# EAGLE board snesram (EAGLE 5.04), part 1 of 2
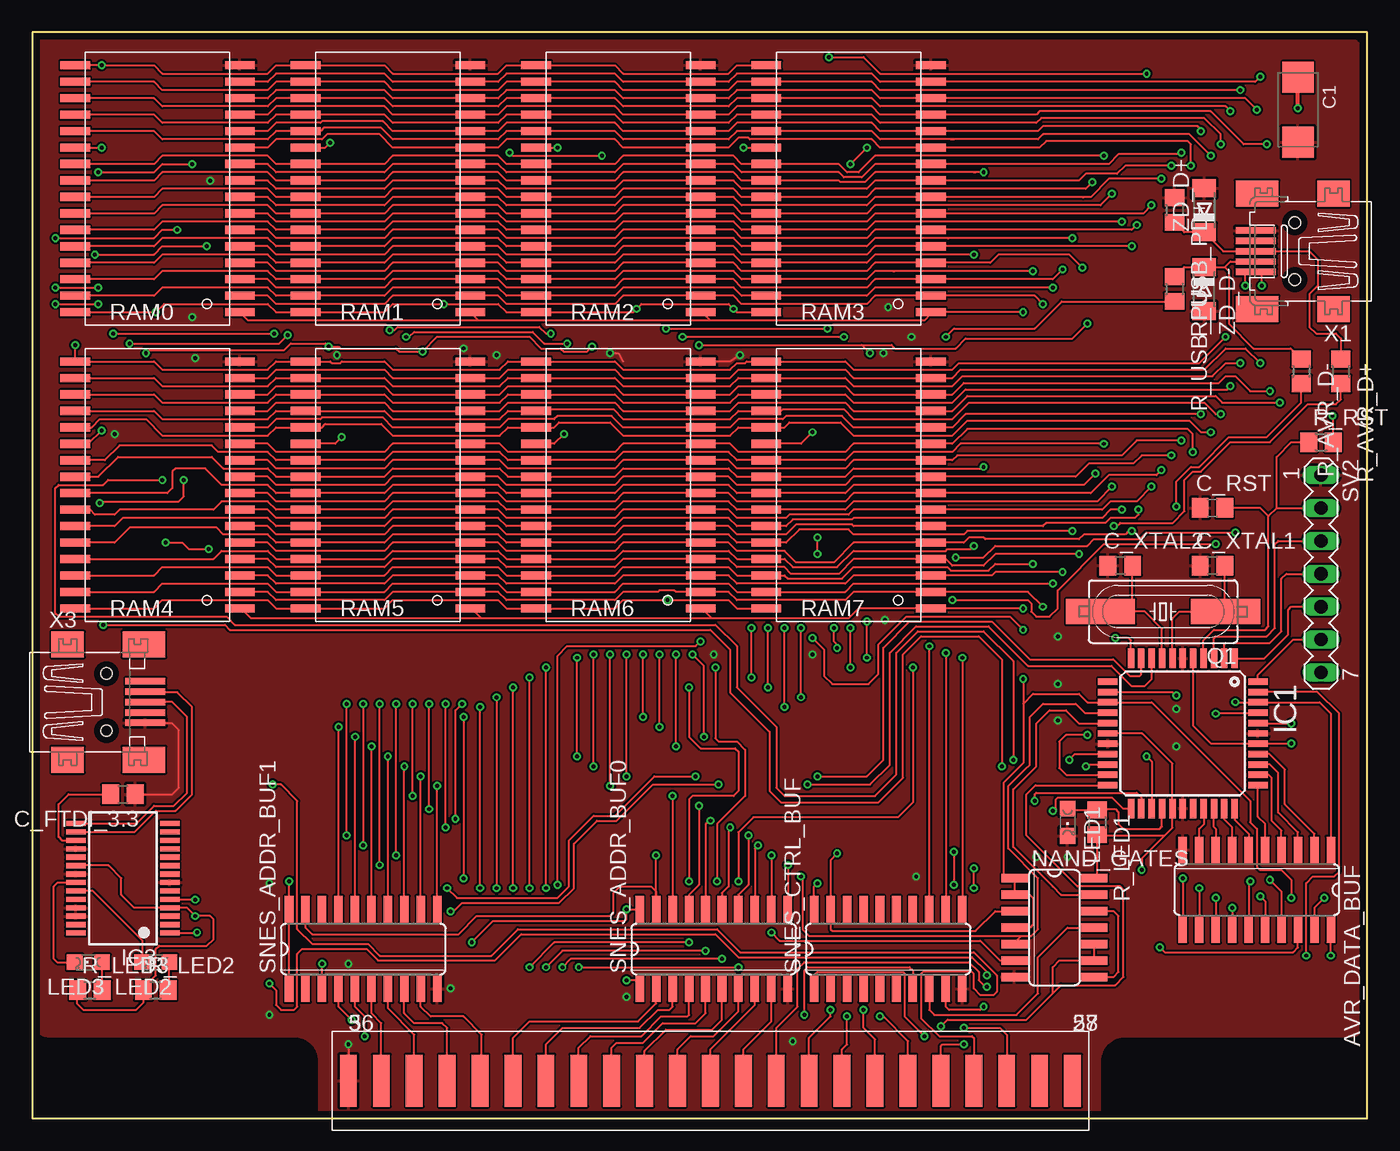
[diagram p2: board, top side]
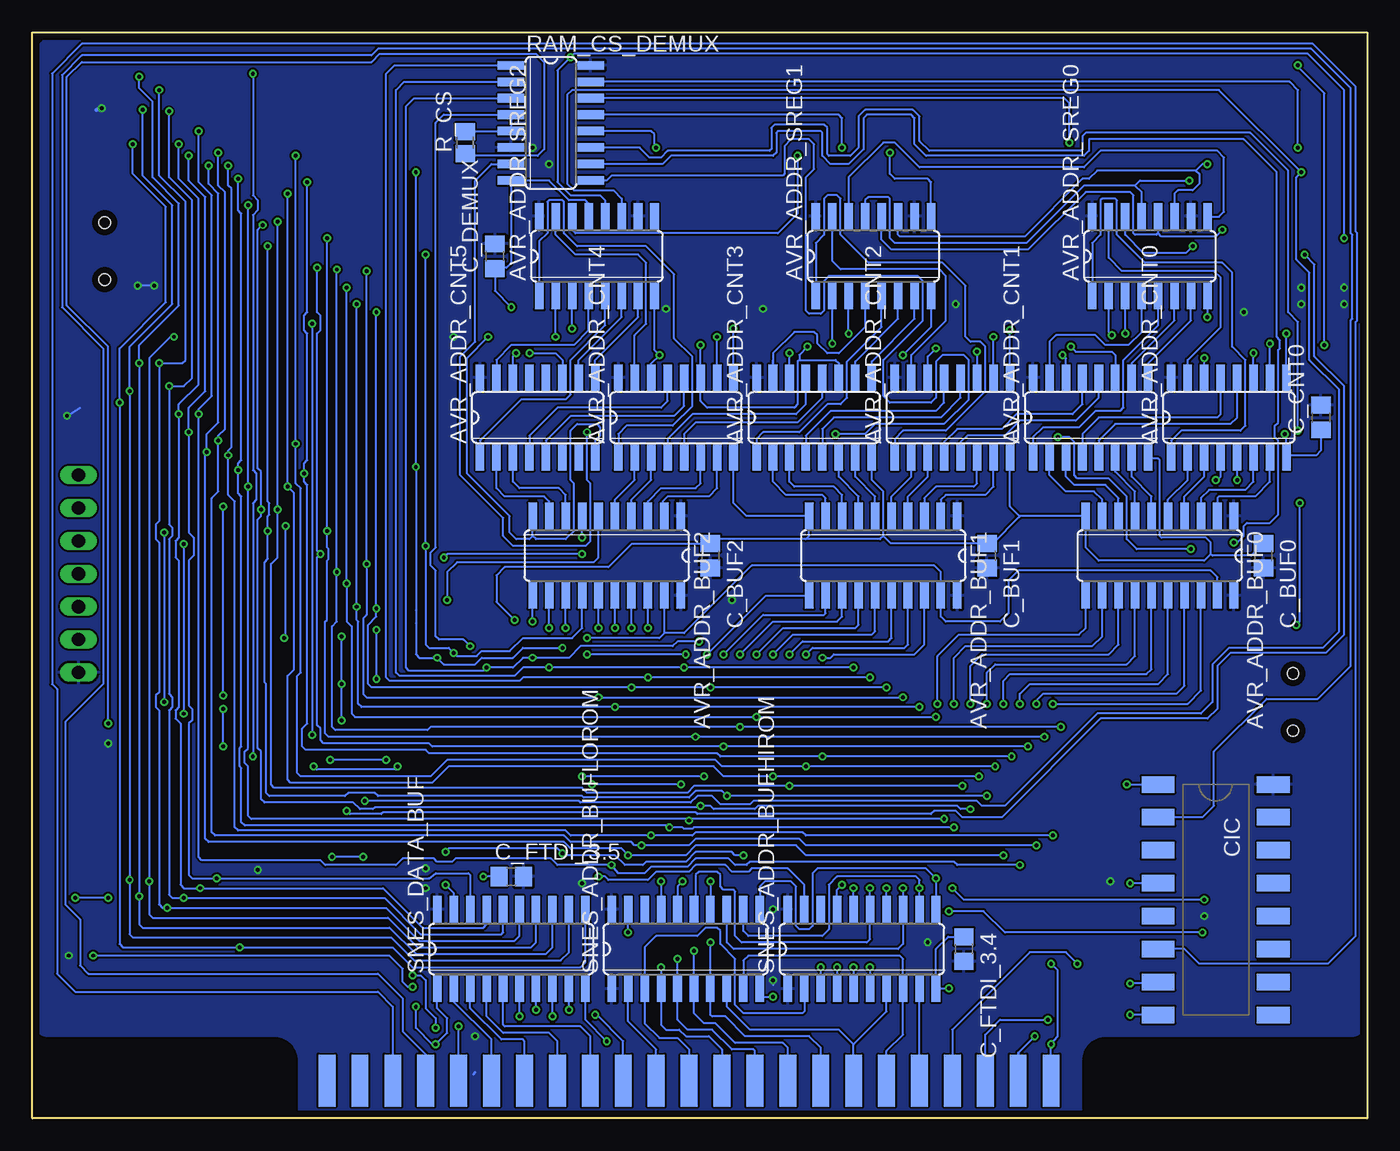
[diagram p3: board, bottom side, seen from below]

Size 103 x 83.82 mm. Coordinates in mm from the lower left corner, seen from the top.
Outline: 103,0 103,83.82 0,83.82 0,0 103,0
Copper layers (1*16): Top 0.035mm / dielectric 1.5mm / Bottom 0.035mm
Design rules "PCB-POOL *": minimum track width 6mil, minimum drill 12mil, track to track 6mil, track to pad 6mil, pad to pad 6mil, via to via 6mil, smd to smd 6mil, copper to edge 20mil, drill to drill 8mil, minimum pad ring 8mil, minimum via ring 6mil, stop-mask expansion 3mil, vias tented up to drill 99mil, thermal gap 8mil

## Footprints (pad centres in the part's own frame; a part is rotated, then mirrored left to right if it is on the bottom)
SO20 = smd 0.66 x 2.032: 1 -5.715,-3.073; 2 -4.445,-3.073; 3 -3.175,-3.073; 4 -1.905,-3.073; 5 -0.635,-3.073; 6 0.635,-3.073; 7 1.905,-3.073; 8 3.175,-3.073; 9 4.445,-3.073; 10 5.715,-3.073; 11 5.715,3.073; 12 4.445,3.073; 13 3.175,3.073; 14 1.905,3.073; 15 0.635,3.073; 16 -0.635,3.073; 17 -1.905,3.073; 18 -3.175,3.073; 19 -4.445,3.073; 20 -5.715,3.073
SO16 = smd 0.66 x 2.032: 1 -4.445,-3.073; 2 -3.175,-3.073; 3 -1.905,-3.073; 4 -0.635,-3.073; 5 0.635,-3.073; 6 1.905,-3.073; 7 3.175,-3.073; 8 4.445,-3.073; 9 4.445,3.073; 10 3.175,3.073; 11 1.905,3.073; 12 0.635,3.073; 13 -0.635,3.073; 14 -1.905,3.073; 15 -3.175,3.073; 16 -4.445,3.073
SMC_C = smd 2.4 x 2.4: + -2.5,0; - 2.5,0
C0805 = smd 1.3 x 1.5: 1 -0.95,0; 2 0.95,0
DIL16_SMD = smd 1.27 x 2.54: 1 -8.89,-4.445; 2 -6.35,-4.445; 3 -3.81,-4.445; 4 -1.27,-4.445; 5 1.27,-4.445; 6 3.81,-4.445; 7 6.35,-4.445; 8 8.89,-4.445; 9 8.89,4.445; 10 6.35,4.445; 11 3.81,4.445; 12 1.27,4.445; 13 -1.27,4.445; 14 -3.81,4.445; 15 -6.35,4.445; 16 -8.89,4.445
TQFP44 = smd 1.5 x 0.5: 1 -5.8,4; 2 -5.8,3.2; 3 -5.8,2.4; 4 -5.8,1.6; 5 -5.8,0.8; 6 -5.8,0; 7 -5.8,-0.8; 8 -5.8,-1.6; 9 -5.8,-2.4; 10 -5.8,-3.2; 11 -5.8,-4; 23 5.8,-4; 24 5.8,-3.2; 25 5.8,-2.4; 26 5.8,-1.6; 27 5.8,-0.8; 28 5.8,0; 29 5.8,0.8; 30 5.8,1.6; 31 5.8,2.4; 32 5.8,3.2; 33 5.8,4 | smd 0.5 x 1.5: 12 -4,-5.8; 13 -3.2,-5.8; 14 -2.4,-5.8; 15 -1.6,-5.8; 16 -0.8,-5.8; 17 0,-5.8; 18 0.8,-5.8; 19 1.6,-5.8; 20 2.4,-5.8; 21 3.2,-5.8; 22 4,-5.8; 34 4,5.8; 35 3.2,5.8; 36 2.4,5.8; 37 1.6,5.8; 38 0.8,5.8; 39 0,5.8; 40 -0.8,5.8; 41 -1.6,5.8; 42 -2.4,5.8; 43 -3.2,5.8; 44 -4,5.8
SSOP28 = smd 0.4 x 1.5: 1 -4.225,-3.625; 2 -3.575,-3.625; 3 -2.925,-3.625; 4 -2.275,-3.625; 5 -1.625,-3.625; 6 -0.975,-3.625; 7 -0.325,-3.625; 8 0.325,-3.625; 9 0.975,-3.625; 10 1.625,-3.625; 11 2.275,-3.625; 12 2.925,-3.625; 13 3.575,-3.625; 14 4.225,-3.625; 15 4.225,3.625; 16 3.575,3.625; 17 2.925,3.625; 18 2.275,3.625; 19 1.625,3.625; 20 0.975,3.625; 21 0.325,3.625; 22 -0.325,3.625; 23 -0.975,3.625; 24 -1.625,3.625; 25 -2.275,3.625; 26 -2.925,3.625; 27 -3.575,3.625; 28 -4.225,3.625
CHIPLED_0805 = smd 1.2 x 1.2: A 0,-1.05; C 0,1.05
SO14 = smd 0.66 x 2.032: 1 -3.81,-3.073; 2 -2.54,-3.073; 3 -1.27,-3.073; 4 0,-3.073; 5 1.27,-3.073; 6 2.54,-3.073; 7 3.81,-3.073; 8 3.81,3.073; 9 2.54,3.073; 10 1.27,3.073; 11 0,3.073; 12 -1.27,3.073; 13 -2.54,3.073; 14 -3.81,3.073
HC49UP = smd 5.334 x 1.93: 1 -4.826,0; 2 4.826,0
R0805 = smd 1.3 x 1.5: 1 -0.95,0; 2 0.95,0
R0805' = smd 1.3 x 1.5: 1 -0.85,0; 2 0.85,0
SOP-32 = smd 2.286 x 0.635: 1 -6.35,9.525; 2 -6.35,8.255; 3 -6.35,6.985; 4 -6.35,5.715; 5 -6.35,4.445; 6 -6.35,3.175; 7 -6.35,1.905; 8 -6.35,0.635; 9 -6.35,-0.635; 10 -6.35,-1.905; 11 -6.35,-3.175; 12 -6.35,-4.445; 13 -6.35,-5.715; 14 -6.35,-6.985; 15 -6.35,-8.255; 16 -6.35,-9.525; 17 6.35,-9.525; 18 6.35,-8.255; 19 6.35,-6.985; 20 6.35,-5.715; 21 6.35,-4.445; 22 6.35,-3.175; 23 6.35,-1.905; 24 6.35,-0.635; 25 6.35,0.635; 26 6.35,1.905; 27 6.35,3.175; 28 6.35,4.445; 29 6.35,5.715; 30 6.35,6.985; 31 6.35,8.255; 32 6.35,9.525
MA07-1 = drill 1.016 long: 1 -7.62,0; 2 -5.08,0; 3 -2.54,0; 4 0,0; 5 2.54,0; 6 5.08,0; 7 7.62,0
1X31_SNES_HEADER = smd 1.3 x 4: P5 -27.94,0; P6 -25.4,0; P7 -22.86,0; P8 -20.32,0; P9 -17.78,0; P10 -15.24,0; P11 -12.7,0; P12 -10.16,0; P13 -7.62,0; P14 -5.08,0; P15 -2.54,0; P16 0,0; P17 2.54,0; P18 5.08,0; P19 7.62,0; P20 10.16,0; P21 12.7,0; P22 15.24,0; P23 17.78,0; P24 20.32,0; P25 22.86,0; P26 25.4,0; P27 27.94,0
1X31_SNES_HEADERBACK = smd 1.3 x 4 bottom: 36 -27.94,0; 37 -25.4,0; 38 -22.86,0; 39 -20.32,0; 40 -17.78,0; 41 -15.24,0; 42 -12.7,0; 43 -10.16,0; 44 -7.62,0; 45 -5.08,0; 46 -2.54,0; 47 0,0; 48 2.54,0; 49 5.08,0; 50 7.62,0; 51 10.16,0; 52 12.7,0; 53 15.24,0; 54 17.78,0; 55 20.32,0; 56 22.86,0; 57 25.4,0; 58 27.94,0
32005-201 = smd 3.1 x 0.5: 1 3,1.6; 2 3,0.8; 3 3,0; 4 3,-0.8; 5 3,-1.6 | smd 2.5 x 2: M1 -3,-4.45; M2 -3,4.45 | smd 3.3 x 2: M3 2.9,4.45; M4 2.9,-4.45 | hole 0.9: 0,2.2; 0,-2.2
32005-301 = smd 3.1 x 0.5: 1 3,1.6; 2 3,0.8; 3 3,0; 4 3,-0.8; 5 3,-1.6 | smd 2.5 x 2: M1 -3,-4.45; M2 -3,4.45 | smd 3.3 x 2: M3 2.9,4.45; M4 2.9,-4.45 | hole 0.9: 0,2.2; 0,-2.2
MINIMELF = smd 1.4 x 1.8: A 1.7,0; C -1.7,0

## Placement (x,y rotation side)
AVR_ADDR_BUF0  74245  [SO20]  16,43.43 180 bottom
AVR_ADDR_BUF1  74245  [SO20]  37.34,43.43 180 bottom
AVR_ADDR_BUF2  74245  [SO20]  58.67,43.43 180 bottom
AVR_ADDR_CNT0  40193D  [SO16]  10.67,54.1 0 bottom
AVR_ADDR_CNT1  40193D  [SO16]  21.34,54.1 0 bottom
AVR_ADDR_CNT2  40193D  [SO16]  32,54.1 0 bottom
AVR_ADDR_CNT3  40193D  [SO16]  42.67,54.1 0 bottom
AVR_ADDR_CNT4  40193D  [SO16]  53.34,54.1 0 bottom
AVR_ADDR_CNT5  40193D  [SO16]  64.01,54.1 0 bottom
AVR_ADDR_SREG0  74HCT595D  [SO16]  16.76,66.55 0 bottom
AVR_ADDR_SREG1  74HCT595D  [SO16]  38.1,66.55 0 bottom
AVR_ADDR_SREG2  74HCT595D  [SO16]  59.44,66.55 0 bottom
AVR_DATA_BUF  74245  [SO20]  94.49,17.65 180 top
C1  [SMC_C]  97.66,77.85 270 top
C_BUF0  100n  [C0805]  8,43.43 270 bottom
C_BUF1  100n  [C0805]  29.34,43.43 270 bottom
C_BUF2  100n  [C0805]  50.67,43.43 270 bottom
C_CNT0  100n  [C0805]  3.56,54.1 90 bottom
C_DEMUX  100n  [C0805]  67.31,66.55 90 bottom
C_FTDI_3.3  100n  [C0805]  6.99,25.02 180 top
C_FTDI_3.4  100n  [C0805]  31.12,13.08 270 bottom
C_FTDI_3.5  100n  [C0805]  66.04,18.67 0 bottom
C_RST  47n  [C0805]  91.06,47.12 0 top
C_XTAL1  22p  [C0805]  91.06,42.67 0 top
C_XTAL2  22p  [C0805]  83.95,42.67 0 top
CIC  DIL16_SMD  [DIL16_SMD]  11.68,16.89 270 bottom
IC1  ATMEGA644A  [TQFP44]  88.77,29.72 270 top
IC3  FT232RL  [SSOP28]  6.99,18.54 90 top
LED1  2-4mA  [CHIPLED_0805]  79.88,22.86 180 top
LED2  2-4mA  [CHIPLED_0805]  9.52,12.06 90 top
LED3  2-4mA  [CHIPLED_0805]  4.32,12.06 90 top
NAND_GATES  74S00D  [SO14]  78.87,14.73 270 top
Q1  20MHz  [HC49UP]  87.25,39.12 180 top
R_AVR_D+  68  [R0805]  100.97,57.66 270 top
R_AVR_D-  68  [R0805]  97.92,57.66 270 top
R_CS  200  [R0805']  69.6,75.31 90 bottom
R_LED1  1k6  [R0805]  82.17,22.86 270 top
R_LED2  1k6  [R0805]  9.52,9.91 0 top
R_LED3  1k6  [R0805]  4.45,9.91 0 top
R_RST  4k7  [R0805]  99.44,52.2 0 top
R_USB_PD+  1M  [R0805]  88.14,70.1 270 top
R_USB_PU-  1k5  [R0805]  88.14,64.01 270 top
RAM0  KM628512-XX  [SOP-32]  9.65,71.75 180 top
RAM1  KM628512-XX  [SOP-32]  27.43,71.75 180 top
RAM2  KM628512-XX  [SOP-32]  45.21,71.75 180 top
RAM3  KM628512-XX  [SOP-32]  62.99,71.75 180 top
RAM4  KM628512-XX  [SOP-32]  9.65,48.9 180 top
RAM5  KM628512-XX  [SOP-32]  27.43,48.9 180 top
RAM6  KM628512-XX  [SOP-32]  45.21,48.9 180 top
RAM7  KM628512-XX  [SOP-32]  62.99,48.9 180 top
RAM_CS_DEMUX  74LS138D  [SO16]  62.99,76.83 270 bottom
SNES_ADDR_BUF0  74245  [SO20]  52.58,13.08 0 top
SNES_ADDR_BUF1  74245  [SO20]  25.53,13.08 0 top
SNES_ADDR_BUFHIROM  74245  [SO20]  38.99,13.08 0 bottom
SNES_ADDR_BUFLOROM  74245  [SO20]  52.58,13.08 0 bottom
SNES_CTRL_BUF  74245  [SO20]  66.04,13.08 0 top
SNES_DATA_BUF  74245  [SO20]  66.04,13.08 0 bottom
SV2  [MA07-1]  99.44,42.04 270 top
U$1  SNES_CON_1  [1X31_SNES_HEADER]  52.32,2.92 0 top
U$2  SNES_CON_2  [1X31_SNES_HEADERBACK]  52.32,2.92 0 top
X1  MINI-USB  [32005-201]  97.41,66.93 180 top
X3  MINI-USB-32005-301  [32005-301]  5.71,32.13 0 top
ZD_D+  3.6V  [MINIMELF]  90.42,70.1 90 top
ZD_D-  3.6V  [MINIMELF]  90.42,64.01 270 top

## Tracks (layer width: path | path; a pad name or v marks a point on that pad's centre or on a via)
A0  (via drill 0.3, 0.3 pad 0.61)
  Top 0.152: RAM0.12 18.16,76.2 18.8,76.83 22.23,76.83 22.35,76.96 27.05,76.96 27.81,76.2 RAM1.12 35.94,76.2 36.58,76.83 44.96,76.83 45.59,76.2 RAM2.12 53.72,76.2 54.36,76.83 64.77,76.83 65.41,76.2 RAM3.12 77.6,76.2 77.98,76.58 89.92,76.58 90.17,76.33 v90.17,76.2 | RAM4.12 18.16,53.34 18.8,53.98 22.23,53.98 22.35,54.1 27.05,54.1 27.81,53.34 RAM5.12 36.07,53.34 36.7,53.98 40.26,53.98 40.51,54.23 44.7,54.23 45.59,53.34 RAM6.12 53.85,53.34 54.48,53.98 57.91,53.98 58.17,54.23 62.48,54.23 63.37,53.34 RAM7.12 70.99,53.34 72.01,54.36 v90.17,54.36 | v58.29,19.56 SNES_ADDR_BUF0.11 | v26.8,19.56 v26.8,32
  Bottom 0.152: v90.17,76.2 90.17,72.26 89.15,71.25 89.15,55.75 90.17,54.74 v90.17,54.36 90.17,20.19 89.92,19.94 80.77,19.94 80.39,19.56 74.93,19.56 74.42,20.07 72.01,20.07 71.76,19.81 70.61,19.81 70.36,20.07 62.99,20.07 62.48,19.56 v58.29,19.56 57.78,18.92 55.75,18.92 55.24,19.43 52.45,19.43 51.82,20.07 49.28,20.07 48.77,19.56 47.88,19.56 47.62,19.81 31.88,19.81 31.62,19.56 v26.8,19.56 | v26.8,32 26.8,32.77 26.04,33.53 16.13,33.53 15.37,34.29 AVR_ADDR_BUF0.16
A1  (via drill 0.3, 0.3 pad 0.61)
  Top 0.152: RAM0.11 18.16,74.93 18.8,75.56 22.35,75.56 22.73,75.95 26.8,75.95 27.81,74.93 RAM1.11 35.94,74.93 36.58,75.56 44.96,75.56 45.59,74.93 RAM2.11 53.72,74.93 54.48,75.69 55.24,75.69 55.37,75.56 64.77,75.56 65.41,74.93 RAM3.11 77.72,74.93 78.23,75.44 89.15,75.44 89.41,75.18 v89.41,73.53 | RAM4.11 18.16,52.07 18.8,51.44 27.18,51.44 27.81,52.07 RAM5.11 36.07,52.07 36.7,51.44 44.96,51.44 45.59,52.07 RAM6.11 53.85,52.07 54.48,51.44 62.74,51.44 63.37,52.07 RAM7.11 70.99,52.07 72.14,53.21 89.15,53.21 89.54,52.83 v89.54,51.44 | v57.02,20.32 SNES_ADDR_BUF0.12 | v28.07,20.32 v28.07,32
  Bottom 0.152: v89.41,73.53 89.41,72.14 88.65,71.37 88.65,53.72 89.54,52.83 v89.54,51.44 89.66,51.31 89.66,21.59 89.41,21.34 61.98,21.34 61.47,20.83 57.53,20.83 v57.02,20.32 52.58,20.32 51.82,21.08 44.07,21.08 43.31,20.32 v28.07,20.32 | v28.07,32 28.07,33.78 27.56,34.29 17.02,34.29 16.64,34.67 AVR_ADDR_BUF0.15
A2  (via drill 0.3, 0.3 pad 0.61)
  Top 0.152: RAM0.10 18.16,73.66 18.8,73.03 27.18,73.03 27.81,73.66 RAM1.10 35.94,73.66 36.58,73.03 44.96,73.03 45.59,73.66 RAM2.10 54.1,73.66 54.74,73.03 62.23,73.03 62.61,72.64 64.01,72.64 65.02,73.66 RAM3.10 83.06,73.66 83.82,74.42 88.52,74.42 v88.65,74.55 | RAM4.10 18.16,50.8 18.8,50.16 27.18,50.16 27.81,50.8 RAM5.10 36.07,50.8 36.7,50.16 44.96,50.16 45.59,50.8 RAM6.10 53.72,50.8 54.36,50.16 62.74,50.16 63.37,50.8 RAM7.10 70.99,50.8 71.37,51.18 84.07,51.18 85.22,52.32 v88.65,52.32 | SNES_ADDR_BUF0.13 55.75,20.83 v56.01,21.08 | v25.53,32 v25.53,21.08
  Bottom 0.152: v88.65,74.55 88.65,72.01 88.14,71.5 88.14,53.21 88.65,52.7 v88.65,52.32 88.65,48.39 89.15,47.88 89.15,22.1 88.9,21.84 61.98,21.84 61.47,21.34 56.77,21.34 56.52,21.08 v56.01,21.08 52.32,21.08 51.82,21.59 43.81,21.59 43.31,21.08 v25.53,21.08 | v25.53,32 25.53,32.26 25.02,32.77 14.73,32.77 14.1,33.4 AVR_ADDR_BUF0.17
A3  (via drill 0.3, 0.3 pad 0.61)
  Top 0.152: RAM0.9 18.16,72.39 18.8,71.75 27.18,71.75 27.81,72.39 RAM1.9 35.94,72.39 36.58,71.75 44.96,71.75 45.59,72.39 RAM2.9 54.1,72.39 54.74,71.75 64.39,71.75 65.02,72.39 RAM3.9 80.77,72.39 81.28,72.9 83.69,72.9 84.33,73.53 v87.88,73.53 | RAM4.9 18.16,49.53 18.8,48.9 27.18,48.9 27.81,49.53 RAM5.9 35.94,49.53 36.58,48.9 44.96,48.9 45.59,49.53 RAM6.9 53.72,49.53 54.36,48.9 62.74,48.9 63.37,49.53 RAM7.9 80.52,49.53 81.53,50.55 84.96,50.55 85.6,51.18 v87.88,51.18 | SNES_ADDR_BUF0.14 54.48,17.27 55.24,18.03 v55.24,21.84 | v24.26,21.84 v24.26,32
  Bottom 0.152: v87.88,73.53 87.88,72.01 87.63,71.75 87.63,51.82 87.88,51.56 v87.88,51.18 87.88,48.13 87.38,47.62 87.38,22.48 87.12,22.23 61.85,22.23 61.47,21.84 v55.24,21.84 52.07,21.84 51.82,22.1 43.56,22.1 43.31,21.84 v24.26,21.84 | v24.26,32 13.84,32 12.83,33.02 AVR_ADDR_BUF0.18
A4  (via drill 0.3, 0.3 pad 0.61)
  Top 0.152: RAM0.8 18.16,71.12 18.8,70.48 27.18,70.48 27.81,71.12 RAM1.8 35.94,71.12 36.58,70.48 44.96,70.48 45.59,71.12 RAM2.8 54.1,71.12 54.74,70.48 64.39,70.48 65.02,71.12 RAM3.8 81.03,71.12 | RAM4.8 18.16,48.26 18.8,47.62 27.18,47.62 27.81,48.26 RAM5.8 35.94,48.26 36.58,47.62 44.96,47.62 45.59,48.26 RAM6.8 53.72,48.26 54.36,47.62 62.74,47.62 63.37,48.26 RAM7.8 81.66,48.26 83.06,49.66 86.74,49.66 v87.12,50.04 | 81.03,71.12 81.15,71.12 | 81.03,71.12 81.66,71.12 83.06,72.52 v87.12,72.52 | SNES_ADDR_BUF0.15 53.21,17.4 53.72,17.91 53.72,22.48 v53.85,22.48 | v31.88,22.48 v31.88,32
  Bottom 0.152: v87.12,72.52 87.12,70.1 86.87,69.85 86.87,50.8 87.12,50.55 v87.12,50.04 87.12,48.26 86.87,48.01 86.87,28.7 87,28.57 87,27.18 86.87,27.05 86.87,22.86 86.61,22.61 53.97,22.61 v53.85,22.48 52.83,22.48 52.7,22.35 52.07,22.35 51.94,22.48 v31.88,22.48 | v31.88,32 31.88,35.56 30.99,36.45 21.21,36.45 20.45,37.21 AVR_ADDR_BUF0.12
A5  (via drill 0.3, 0.3 pad 0.61)
  Top 0.152: RAM0.7 18.16,69.85 18.8,69.22 27.18,69.22 27.81,69.85 RAM1.7 35.94,69.85 36.58,69.22 44.96,69.22 45.59,69.85 RAM2.7 54.1,69.85 54.74,69.22 64.39,69.22 65.02,69.85 RAM3.7 85.73,69.85 v86.36,70.48 | RAM4.7 18.16,46.99 18.8,46.35 27.18,46.35 27.81,46.99 RAM5.7 35.94,46.99 36.58,46.35 44.96,46.35 45.59,46.99 RAM6.7 53.72,46.99 54.36,46.35 58.17,46.35 58.42,46.61 62.99,46.61 63.37,46.99 RAM7.7 82.55,46.99 83.19,47.62 85.22,47.62 v86.36,48.77 | SNES_ADDR_BUF0.16 51.94,22.73 v52.32,22.99 | v33.15,32 32.64,31.5 v32.64,23.11
  Bottom 0.152: v86.36,70.48 v86.36,48.77 86.36,28.57 86.61,28.32 86.61,27.43 86.36,27.18 86.36,23.37 86.11,23.11 52.32,23.11 v52.32,22.99 52.2,23.11 v32.64,23.11 | AVR_ADDR_BUF0.11 21.72,37.85 22.23,37.34 31.5,37.34 33.15,35.69 v33.15,32
A6  (via drill 0.3, 0.3 pad 0.61)
  Top 0.152: RAM0.6 18.16,68.58 18.8,67.94 27.18,67.94 27.81,68.58 RAM1.6 35.94,68.58 36.58,67.94 44.96,67.94 45.59,68.58 RAM2.6 54.1,68.58 54.74,67.94 64.39,67.94 65.02,68.58 RAM3.6 84.84,68.58 v85.22,68.96 | RAM4.6 18.16,45.72 18.8,45.09 27.18,45.09 27.81,45.72 RAM5.6 35.94,45.72 36.58,45.09 44.96,45.09 45.59,45.72 RAM6.6 53.72,45.72 54.36,45.09 58.17,45.09 58.93,45.85 63.25,45.85 63.37,45.72 RAM7.6 77.98,45.72 78.23,45.97 82.8,45.97 83.19,46.35 85.09,46.35 85.34,46.61 v85.34,46.99 | SNES_ADDR_BUF0.17 50.67,17.27 51.43,18.03 v51.43,24.13 | v30.61,23.88 v30.61,32
  Bottom 0.152: v85.22,68.96 85.6,68.58 85.6,50.16 85.34,49.91 v85.34,46.99 85.34,46.48 85.6,46.23 85.6,28.57 85.34,28.32 85.34,24.64 85.09,24.38 78.23,24.38 77.72,23.88 76.71,23.88 76.58,24 51.56,24 v51.43,24.13 50.67,24.13 50.42,23.88 47.24,23.88 46.99,24.13 31.62,24.13 31.37,23.88 v30.61,23.88 | v30.61,32 30.61,34.92 29.72,35.81 19.94,35.81 19.18,36.58 AVR_ADDR_BUF0.13
A7  (via drill 0.3, 0.3 pad 0.61)
  Top 0.152: RAM0.5 18.16,67.31 18.8,66.67 27.18,66.67 27.81,67.31 RAM1.5 35.94,67.31 36.58,66.67 44.96,66.67 45.59,67.31 RAM2.5 54.1,67.31 54.74,66.67 64.39,66.67 65.02,67.31 RAM3.5 v84.84,67.31 | RAM4.5 18.16,44.45 18.8,43.81 27.18,43.81 27.81,44.45 RAM5.5 35.94,44.45 36.58,43.81 44.96,43.81 45.59,44.45 RAM6.5 53.72,44.45 54.36,43.81 58.04,43.81 58.93,42.93 61.85,42.93 63.37,44.45 RAM7.5 71.88,44.45 72.26,44.83 73.41,44.83 73.53,44.7 80.77,44.7 81.15,45.09 84.33,45.09 84.58,45.34 v84.84,45.34 | v49.4,24.89 SNES_ADDR_BUF0.18 | v29.34,24.89 v29.34,32
  Bottom 0.152: v84.84,67.31 84.84,47.62 84.71,47.5 84.71,46.61 84.84,46.48 v84.84,45.34 84.84,43.18 85.09,42.93 85.09,33.66 84.96,33.53 84.96,25.15 84.71,24.89 78.87,24.89 78.61,25.15 76.58,25.15 76.33,24.89 60.58,24.89 60.45,24.77 52.32,24.77 51.82,25.27 49.78,25.27 v49.4,24.89 v29.34,24.89 | v29.34,32 29.34,34.42 28.7,35.05 18.54,35.05 17.91,35.69 AVR_ADDR_BUF0.14
A8  (via drill 0.3, 0.3 pad 0.61)
  Top 0.152: RAM0.27 9.4,68.58 10.03,69.22 18.16,69.22 18.8,68.58 RAM1.27 27.18,68.58 27.81,69.22 35.94,69.22 36.58,68.58 RAM2.27 44.96,68.58 45.59,69.22 54.1,69.22 54.74,68.58 RAM3.27 64.39,68.58 65.02,69.22 v84.07,69.22 | RAM4.27 6.35,45.72 6.99,46.35 18.16,46.35 18.8,45.72 RAM5.27 27.18,45.72 27.81,46.35 35.94,46.35 36.58,45.72 RAM6.27 44.96,45.72 45.59,46.35 53.72,46.35 54.36,45.72 RAM7.27 58.17,45.72 58.67,46.23 63.25,46.23 63.37,46.35 82.55,46.35 83.19,46.99 v84.07,46.99 | SNES_ADDR_BUF1.11 v31.24,25.65 | v44.58,25.65 v44.58,35.81
  Bottom 0.152: v84.07,69.22 v84.07,46.99 84.07,43.31 84.58,42.8 84.58,25.78 84.33,25.53 60.58,25.53 60.2,25.15 52.45,25.15 51.94,25.65 v44.58,25.65 v31.24,25.65 | AVR_ADDR_BUF1.16 36.7,37.08 36.96,36.83 43.56,36.83 v44.58,35.81
A9  (via drill 0.3, 0.3 pad 0.61)
  Top 0.152: RAM0.26 9.4,69.85 10.03,70.48 18.16,70.48 18.8,69.85 RAM1.26 27.18,69.85 27.81,70.48 35.94,70.48 36.58,69.85 RAM2.26 44.96,69.85 45.59,70.48 54.1,70.48 54.74,69.85 RAM3.26 64.39,69.85 65.02,70.48 82.42,70.48 v83.31,71.37 | RAM4.26 4.45,46.99 4.83,46.61 6.35,46.61 6.73,46.99 13.97,46.99 14.6,47.62 18.16,47.62 18.8,46.99 RAM5.26 27.18,46.99 27.81,47.62 35.94,47.62 36.58,46.99 RAM6.26 44.96,46.99 45.59,47.62 53.72,47.62 54.36,46.99 RAM7.26 62.74,46.99 63.37,47.62 82.17,47.62 v83.31,48.77 | SNES_ADDR_BUF1.12 v29.97,26.42 | v45.85,26.42 v45.85,35.81
  Bottom 0.152: v83.31,71.37 v83.31,48.77 82.8,48.26 82.8,34.67 83.31,34.16 83.31,26.16 83.06,25.91 72.14,25.91 70.87,27.18 50.42,27.18 49.66,26.42 v45.85,26.42 v29.97,26.42 | AVR_ADDR_BUF1.15 37.97,37.59 38.23,37.34 44.32,37.34 v45.85,35.81
A10  (via drill 0.3, 0.3 pad 0.61)
  Top 0.152: RAM0.23 9.4,73.66 10.03,74.3 18.16,74.3 18.8,73.66 RAM1.23 27.18,73.66 27.81,74.3 35.94,74.3 36.58,73.66 RAM2.23 44.96,73.66 45.59,74.3 54.1,74.3 54.74,73.66 RAM3.23 62.23,73.66 62.86,73.03 63.75,73.03 65.02,74.3 v82.68,74.3 | RAM4.23 5.59,50.8 6.73,51.94 13.84,51.94 14.35,51.44 18.16,51.44 18.8,50.8 RAM5.23 27.18,50.8 27.81,51.44 36.07,51.44 36.7,50.8 RAM6.23 44.96,50.8 45.59,51.44 53.72,51.44 54.36,50.8 RAM7.23 62.74,50.8 63.37,51.44 70.99,51.44 71.63,52.07 v82.68,52.07 | SNES_ADDR_BUF1.13 v28.7,27.18 | v43.31,27.18 v43.31,35.81
  Bottom 0.152: v82.68,74.3 v82.68,52.07 82.68,49.02 82.3,48.64 82.3,34.42 82.55,34.16 82.55,26.67 82.3,26.42 72.26,26.42 70.99,27.69 50.29,27.69 49.78,27.18 v43.31,27.18 v28.7,27.18 | AVR_ADDR_BUF1.17 35.43,36.58 35.69,36.32 42.8,36.32 v43.31,35.81
A11  (via drill 0.3, 0.3 pad 0.61)
  Top 0.152: RAM0.25 9.4,71.12 10.03,71.75 18.16,71.75 18.8,71.12 RAM1.25 27.18,71.12 27.81,71.75 35.94,71.75 36.58,71.12 RAM2.25 44.96,71.12 45.59,71.75 54.1,71.75 54.74,71.12 RAM3.25 64.39,71.12 65.02,71.75 81.28,71.75 v81.79,72.26 | v82.04,49.78 81.15,48.9 63.37,48.9 62.74,48.26 RAM7.25 54.36,48.26 53.72,48.9 45.59,48.9 44.96,48.26 RAM6.25 36.58,48.26 35.94,48.9 27.81,48.9 27.18,48.26 RAM5.25 18.8,48.26 18.16,48.9 14.6,48.9 13.33,50.16 11.05,50.16 10.79,49.91 10.79,48.64 10.41,48.26 RAM4.25 | SNES_ADDR_BUF1.14 v27.43,27.94 | v42.04,27.94 v42.04,35.56
  Bottom 0.152: v81.79,72.26 81.79,62.23 82.04,61.98 82.04,60.83 81.79,60.58 81.79,50.8 82.04,50.55 v82.04,49.78 82.04,49.15 81.79,48.9 81.79,30.48 82.17,30.1 82.17,28.7 81.92,28.45 72.64,28.45 72.39,28.19 50.16,28.19 49.91,27.94 v42.04,27.94 v27.43,27.94 | v42.04,35.56 41.4,35.56 41.15,35.81 34.92,35.81 34.16,36.58 AVR_ADDR_BUF1.18
A12  (via drill 0.3, 0.3 pad 0.61)
  Top 0.152: RAM0.4 18.16,66.04 18.8,65.41 27.18,65.41 27.81,66.04 RAM1.4 35.94,66.04 36.58,65.41 44.96,65.41 45.59,66.04 RAM2.4 54.1,66.04 54.74,65.41 64.39,65.41 65.02,66.04 RAM3.4 73.91,66.04 74.55,66.67 80.01,66.67 v81.03,65.66 | RAM4.4 18.16,43.18 18.8,42.55 27.18,42.55 27.81,43.18 RAM5.4 35.94,43.18 36.58,42.55 44.96,42.55 45.59,43.18 RAM6.4 53.72,43.18 54.36,42.55 58.04,42.55 58.55,42.04 62.23,42.04 63.37,43.18 RAM7.4 70.48,43.18 70.99,42.67 73.41,42.67 74.3,43.56 v80.77,43.56 | SNES_ADDR_BUF1.15 v26.16,28.7 | v49.66,28.7 v49.66,35.81
  Bottom 0.152: v81.03,65.66 81.03,62.23 80.77,61.98 80.77,60.83 81.03,60.58 81.03,43.81 v80.77,43.56 81.03,43.31 81.03,30.35 80.77,30.1 80.77,29.21 80.52,28.96 72.39,28.96 72.14,28.7 v49.66,28.7 v26.16,28.7 | AVR_ADDR_BUF1.12 41.78,38.99 41.91,38.86 46.61,38.86 v49.66,35.81
A13  (via drill 0.3, 0.3 pad 0.61)
  Top 0.152: RAM0.28 9.4,67.31 10.03,67.94 18.16,67.94 18.8,67.31 RAM1.28 27.18,67.31 27.81,67.94 35.94,67.94 36.58,67.31 RAM2.28 44.96,67.31 45.59,67.94 54.1,67.94 54.74,67.31 RAM3.28 64.39,67.31 65.02,67.94 70.61,67.94 | RAM4.28 6.35,44.45 7.49,45.59 14.22,45.59 14.73,45.09 18.16,45.09 18.8,44.45 RAM5.28 27.18,44.45 27.81,45.09 35.94,45.09 36.58,44.45 RAM6.28 44.96,44.45 45.59,45.09 53.72,45.09 54.36,44.45 RAM7.28 58.17,44.45 59.18,45.47 62.99,45.47 63.37,45.09 71.88,45.09 72.14,45.34 v80.26,45.34 | 70.61,67.94 70.74,67.94 | v80.26,67.94 70.61,67.94 | SNES_ADDR_BUF1.16 v24.89,29.46 | v50.93,35.81 51.82,34.92 v51.82,29.46
  Bottom 0.152: v80.26,67.94 v80.26,45.34 80.26,44.07 80.14,43.94 80.14,43.18 80.26,43.05 80.26,38.48 80.39,38.35 80.39,29.72 80.14,29.46 v51.82,29.46 v24.89,29.46 | AVR_ADDR_BUF1.11 46.38,40.36 v50.93,35.81
A14  (via drill 0.3, 0.3 pad 0.61)
  Top 0.152: RAM0.3 18.16,64.77 18.8,64.14 27.18,64.14 27.81,64.77 RAM1.3 35.94,64.77 36.58,64.14 44.96,64.14 45.59,64.77 RAM2.3 54.1,64.77 54.74,64.14 64.39,64.14 65.02,64.77 RAM3.3 78.74,64.77 v79.5,65.53 | RAM4.3 18.16,41.91 18.8,41.27 27.18,41.27 27.81,41.91 RAM5.3 35.94,41.91 36.58,41.27 44.96,41.27 45.59,41.91 RAM6.3 53.72,41.91 54.36,41.27 62.74,41.27 63.37,41.91 RAM7.3 74.04,41.91 74.3,42.16 v79.5,42.16 | SNES_ADDR_BUF1.17 v23.62,30.23 | v48.39,30.23 v48.39,35.81
  Bottom 0.152: v79.5,65.53 v79.5,42.16 79.5,38.35 79.88,37.97 79.88,30.23 79.63,29.97 72.52,29.97 72.26,30.23 v48.39,30.23 v23.62,30.23 | AVR_ADDR_BUF1.13 40.51,38.73 40.89,38.35 45.85,38.35 v48.39,35.81
A15  (via drill 0.3, 0.3 pad 0.61)
  Top 0.152: RAM0.31 9.4,63.5 10.03,64.14 18.16,64.14 18.8,63.5 RAM1.31 27.18,63.5 27.81,64.14 35.94,64.14 36.58,63.5 RAM2.31 44.96,63.5 45.59,64.14 54.1,64.14 54.74,63.5 RAM3.31 64.39,63.5 65.02,64.14 v78.74,64.14 | RAM4.31 9.4,40.64 10.03,41.27 18.16,41.27 18.8,40.64 RAM5.31 27.18,40.64 27.81,41.27 35.94,41.27 36.58,40.64 RAM6.31 44.96,40.64 45.59,41.27 53.72,41.27 54.36,40.64 RAM7.31 62.74,40.64 63.37,41.27 v78.74,41.27 | v33.27,30.99 v33.27,18.54 | v47.12,30.99 v47.12,35.81
  Bottom 0.152: v78.74,64.14 v78.74,41.27 78.74,38.35 78.36,37.97 78.36,31.24 78.11,30.99 v47.12,30.99 v33.27,30.99 | SNES_ADDR_BUFHIROM.11 v33.27,18.54 34.04,19.3 42.42,19.3 42.8,18.92 42.8,14.86 43.05,14.61 43.81,14.61 44.07,14.86 44.07,17.91 44.45,18.29 46.48,18.29 46.86,17.91 SNES_ADDR_BUFLOROM.11 | AVR_ADDR_BUF1.14 39.24,38.1 39.5,37.85 45.09,37.85 v47.12,35.81
A16  (via drill 0.3, 0.3 pad 0.61)
  Top 0.152: RAM0.2 18.16,63.5 18.8,62.87 27.18,62.87 27.81,63.5 RAM1.2 35.94,63.5 36.58,62.87 44.96,62.87 45.59,63.5 RAM2.2 54.1,63.5 54.74,62.87 64.39,62.87 65.02,63.5 RAM3.2 77.34,63.5 v77.98,62.87 | RAM4.2 18.16,40.64 18.8,40.01 27.18,40.01 27.81,40.64 RAM5.2 35.94,40.64 36.58,40.01 44.96,40.01 45.59,40.64 48.26,40.64 48.39,40.77 49.53,40.77 49.66,40.64 RAM6.2 53.72,40.64 54.36,40.01 62.74,40.01 63.37,40.64 RAM7.2 76.84,40.64 v77.98,39.5 | v34.54,17.78 v34.54,31.75 | v58.04,31.75 v58.04,37.85
  Bottom 0.152: v77.98,62.87 v77.98,39.5 77.98,38.48 77.85,38.35 77.85,32 77.6,31.75 v58.04,31.75 v34.54,31.75 | v34.54,17.78 SNES_ADDR_BUFHIROM.12 34.54,18.41 34.8,18.67 40.89,18.67 41.53,18.03 41.53,14.61 42.04,14.1 47.75,14.1 48.13,14.48 SNES_ADDR_BUFLOROM.12 | v58.04,37.85 AVR_ADDR_BUF2.16
A17  (via drill 0.3, 0.3 pad 0.61)
  Top 0.152: RAM0.30 9.4,64.77 10.03,65.41 18.16,65.41 18.8,64.77 RAM1.30 27.18,64.77 27.81,65.41 35.94,65.41 36.58,64.77 RAM2.30 44.96,64.77 45.59,65.41 54.1,65.41 54.74,64.77 RAM3.30 64.39,64.77 65.02,65.41 66.42,65.41 | RAM4.30 9.4,41.91 10.03,42.55 18.16,42.55 18.8,41.91 RAM5.30 27.18,41.91 27.81,42.55 35.94,42.55 36.58,41.91 RAM6.30 44.96,41.91 45.59,42.55 53.72,42.55 54.36,41.91 RAM7.30 58.04,41.91 58.29,41.66 62.48,41.66 63.37,42.55 70.61,42.55 70.87,42.29 73.79,42.29 74.3,42.8 v77.22,42.8 | 66.42,65.41 66.55,65.41 | v77.22,65.41 66.42,65.41 | v35.81,32.51 v35.81,17.78 | v59.31,32.51 v59.31,37.85
  Bottom 0.152: v77.22,65.41 v77.22,42.8 77.22,38.86 77.47,38.61 77.47,32.77 77.22,32.51 v59.31,32.51 v35.81,32.51 | v35.81,17.78 SNES_ADDR_BUFHIROM.13 35.81,13.46 36.2,13.08 48.89,13.08 49.4,13.59 SNES_ADDR_BUFLOROM.13 | v59.31,37.85 AVR_ADDR_BUF2.15
A18  (via drill 0.3, 0.3 pad 0.61)
  Top 0.152: 34.42,61.59 16.64,61.59 RAM0.1 | 34.42,61.59 RAM1.1 | 52.32,61.59 34.42,61.59 | RAM2.1 51.69,62.23 52.32,61.59 | 52.32,61.59 68.83,61.59 69.34,62.1 RAM3.1 v76.45,62.23 | RAM4.1 16.13,39.37 16.89,38.61 34.67,38.61 | 52.45,38.61 34.67,38.61 | 52.45,38.61 62.99,38.61 63.75,39.37 RAM7.1 v76.45,39.37 | RAM6.1 51.69,39.37 52.45,38.61 | RAM5.1 33.91,39.37 34.67,38.61 | v37.08,17.78 v37.08,33.27 | v56.77,33.27 v56.77,37.85 | v50.67,33.27 50.67,29.46 51.56,28.57 54.23,28.57 54.48,28.32 54.48,25.27 54.1,24.89 50.93,24.89 50.67,24.64 v50.67,18.29
  Bottom 0.152: v76.45,62.23 v76.45,39.37 76.45,38.73 77.09,38.1 77.09,33.53 76.84,33.27 v56.77,33.27 v50.67,33.27 v37.08,33.27 | SNES_ADDR_BUFHIROM.14 v37.08,17.78 | v50.67,18.29 SNES_ADDR_BUFLOROM.14 | v56.77,37.85 AVR_ADDR_BUF2.17
A19  (via drill 0.3, 0.3 pad 0.61)
  Top 0.152: v38.35,17.78 v38.35,34.04 | v55.5,34.04 v55.5,37.85
  Bottom 0.152: RAM_CS_DEMUX.1 75.06,81.28 75.69,80.64 75.69,34.04 75.44,33.78 65.41,33.78 65.15,34.04 v55.5,34.04 v38.35,34.04 | v38.35,17.78 SNES_ADDR_BUFHIROM.15 38.35,13.84 38.61,13.59 48.26,13.59 48.77,14.1 48.77,17.53 48.89,17.65 49.66,17.65 49.91,17.91 49.91,18.8 50.16,19.05 51.56,19.05 51.82,18.8 51.82,16.28 SNES_ADDR_BUFLOROM.15 | v55.5,37.85 AVR_ADDR_BUF2.18
A20  (via drill 0.3, 0.3 pad 0.61)
  Top 0.152: v39.62,17.78 v39.62,34.8 | v63.12,34.8 v63.12,37.85 | v52.83,18.29 52.83,22.73 54.99,24.89 54.99,28.45 54.36,29.08 52.96,29.08 52.7,29.34 v52.7,34.8
  Bottom 0.152: RAM_CS_DEMUX.2 74.3,80.01 74.93,79.38 74.93,34.42 74.68,34.16 65.79,34.16 65.15,34.8 v63.12,34.8 v52.7,34.8 v39.62,34.8 | SNES_ADDR_BUFHIROM.16 v39.62,17.78 | v63.12,37.85 AVR_ADDR_BUF2.12 | SNES_ADDR_BUFLOROM.16 53.21,17.91 v52.83,18.29
A21  (via drill 0.3, 0.3 pad 0.61)
  Top 0.152: v64.39,35.56 v64.39,38.35 | v54.48,18.29 54.48,22.1 55.63,23.24 66.8,23.24 67.95,24.38 v67.95,34.8 | v40.51,18.03 40.51,35.69 41.27,36.45 51.18,36.45 v51.56,36.83
  Bottom 0.152: RAM_CS_DEMUX.3 73.53,78.74 74.17,78.11 74.17,34.8 73.91,34.54 68.2,34.54 v67.95,34.8 65.91,34.8 65.15,35.56 v64.39,35.56 61.59,35.56 60.71,36.45 53.59,36.45 53.21,36.83 v51.56,36.83 | v54.48,18.29 SNES_ADDR_BUFLOROM.17 | v64.39,38.35 AVR_ADDR_BUF2.11 | SNES_ADDR_BUFHIROM.17 40.89,17.65 v40.51,18.03
AVR/SNES_SW  (via drill 0.3)
  Top 0.152: v97.16,17.02 97.16,18.41 96.39,19.18 94.74,19.18 94.49,19.43 94.49,22.35 93.98,22.86 93.98,24.51 86.37,32.12 IC1.14 81.42,32.12 80.77,32.77 77.22,32.77 76.45,32 | v99.7,17.02 98.93,16.26 AVR_DATA_BUF.19 | 76.45,32 76.45,27.43 74.93,25.91 74.93,18.44 NAND_GATES.1 NAND_GATES.2 76.96,17.27 77.22,17.02 77.22,14.99 76.96,14.73 NAND_GATES.4 | v76.45,33.91 76.45,32 | v76.45,37.72 75.44,38.73 67.44,38.73 65.28,36.58 65.28,34.29 64.52,33.53 61.72,33.53 61.09,34.16 61.09,36.2 v60.2,37.08
  Bottom 0.152: v97.16,17.02 v99.7,17.02 | AVR_ADDR_BUF1.19 32.89,42.16 33.4,42.67 47.5,42.67 52.7,37.47 54.23,37.47 | AVR_ADDR_BUF1.19 32.89,42.04 | AVR_ADDR_BUF0.19 11.56,41.78 12.06,42.29 26.92,42.29 27.69,41.53 27.69,38.99 28.32,38.35 32.51,38.35 32.89,38.73 AVR_ADDR_BUF1.19 | v76.45,37.72 v76.45,33.91 | v60.2,37.08 54.61,37.08 54.23,37.47 | 54.23,37.47 AVR_ADDR_BUF2.19
AVR/SNES_SW_INV  (via drill 0.3)
  Top 0.152: NAND_GATES.3 74.3,16 72.77,14.48 61.72,14.48 61.59,14.61 SNES_CTRL_BUF.19 61.59,19.94 v62.1,20.45 | SNES_ADDR_BUF1.19 21.08,14.73 21.59,14.22 32.89,14.22 34.29,15.62 44.58,15.62 44.83,15.88 44.83,17.4 45.34,17.91 47.75,17.91 48.13,17.53 SNES_ADDR_BUF0.19 v48.13,20.32 | v71.12,20.57 v71.12,18.03
  Bottom 0.152: SNES_DATA_BUF.19 70.48,17.4 v71.12,18.03 | v71.12,20.57 70.87,20.83 62.48,20.83 v62.1,20.45 61.98,20.32 58.04,20.32 57.28,19.56 55.88,19.56 55.63,19.81 52.58,19.81 51.82,20.57 49.02,20.57 48.77,20.32 v48.13,20.32
AVR_ADDR_DWN  (via drill 0.3)
  Top 0.152: IC1.20 81.42,27.32 v81.28,27.18 | v74.8,27.18 74.8,35.43 73.03,37.21 68.58,37.21 67.18,35.81 67.18,26.29 65.28,24.38 57.78,24.38 56.9,25.27 56.9,29.84 53.85,32.89 53.85,36.2 52.32,37.72 15.24,37.72 14.86,38.1 v5.46,38.1 | v11.68,49.28 11.68,48.01 11.3,47.62 5.33,47.62 v5.21,47.5
  Bottom 0.152: v74.8,27.18 74.8,27.05 74.93,26.92 81.03,26.92 v81.28,27.18 | v11.68,49.28 11.56,49.28 11.3,49.53 AVR_ADDR_CNT0.4 | v5.21,47.5 5.21,38.35 v5.46,38.1
AVR_ADDR_LATCH  (via drill 0.3)
  Top 0.152: v1.78,67.94 9.4,67.94 10.03,68.58 v11.18,68.58 | IC1.25 86.37,27.55 v85.98,27.94 | v85.98,80.64 65.41,80.64 64.14,81.92 v61.47,81.92
  Bottom 0.152: 16.13,68.33 16.26,68.2 17.91,68.2 18.03,68.33 18.03,71.25 18.29,71.5 21.72,71.5 26.16,67.06 36.7,67.06 37.46,67.82 AVR_ADDR_SREG1.12 | 16.13,68.33 AVR_ADDR_SREG0.12 | AVR_ADDR_SREG2.12 58.8,70.87 59.18,71.25 61.47,71.25 62.48,72.26 62.48,80.9 v61.47,81.92 61.21,82.17 4.57,82.17 1.78,79.38 v1.78,67.94 | v11.18,68.58 11.68,68.07 15.87,68.07 16.13,68.33 | v85.98,80.64 85.98,71.25 85.6,70.87 85.6,70.1 85.98,69.72 85.98,50.04 85.73,49.78 85.73,47.75 85.98,47.5 v85.98,27.94
AVR_ADDR_LOAD  (via drill 0.3)
  Top 0.152: v8.76,59.05 9.02,59.31 19.43,59.31 19.94,59.82 22.61,59.82 v22.86,59.56 23.62,59.56 23.75,59.44 28.07,59.44 28.32,59.18 v30.1,59.18 31.24,60.33 38.35,60.33 39.24,59.44 40.77,59.44 41.02,59.18 42.8,59.18 v43.18,59.56 | v51.43,59.69 64.01,59.69 | 64.01,59.69 v64.64,59.05 | IC1.21 79.78,26.52 79.25,27.05 79.25,29.08 79.76,29.59 v81.41,29.59 | v81.41,61.34 80.26,60.2 72.01,60.2 71.25,59.44 66.55,59.44 66.29,59.69 64.01,59.69
  Bottom 0.152: AVR_ADDR_CNT0.11 v8.76,59.05 | v22.86,59.56 22.48,59.18 19.69,59.18 19.43,58.93 AVR_ADDR_CNT1.11 | v30.1,59.18 AVR_ADDR_CNT2.11 | 43.81,58.55 41.02,58.55 40.77,58.29 AVR_ADDR_CNT3.11 | 43.81,58.55 43.94,58.42 43.94,55.12 44.2,54.86 50.93,54.86 51.43,55.37 AVR_ADDR_CNT4.11 v51.43,59.69 | v43.18,59.56 43.81,58.93 43.81,58.55 | v64.64,59.05 62.61,59.05 62.1,58.55 AVR_ADDR_CNT5.11 | v81.41,61.34 v81.41,29.59
AVR_ADDR_SCK  (via drill 0.3)
  Top 0.152: IC1.24 85.57,24.79 85.22,25.15 77.47,25.15 77.34,25.02 v77.34,24.51 | v5.08,73.03 9.4,73.03 10.03,73.66 v12.32,73.66
  Bottom 0.152: AVR_ADDR_SREG0.11 14.86,71.37 14.6,71.63 13.46,71.63 12.95,72.14 12.95,72.9 13.21,73.15 | AVR_ADDR_SREG1.11 36.2,68.2 36.07,68.07 26.42,68.07 21.97,72.52 21.46,72.52 20.83,73.15 13.21,73.15 | v77.34,24.51 60.83,24.51 60.71,24.38 52.2,24.38 51.69,24.89 50.55,24.89 49.91,24.26 47.62,24.26 47.37,24.51 30.1,24.51 29.72,24.13 27.94,24.13 20.83,31.24 12.83,31.24 11.94,32.13 11.94,35.05 10.67,36.32 3.43,36.32 2.16,37.59 2.16,56.26 4.45,58.55 4.45,65.28 5.46,66.29 5.46,72.64 v5.08,73.03 11.43,79.38 61.34,79.38 61.72,78.99 61.72,72.14 61.21,71.63 58.17,71.63 57.53,70.99 AVR_ADDR_SREG2.11 | v12.32,73.66 12.7,73.66 13.21,73.15
AVR_ADDR_SER  (via drill 0.3)
  Top 0.152: IC1.23 84.16,23.92 83.31,24.77 79.12,24.77 78.99,24.64 78.99,23.88 78.87,23.75 v78.74,23.75 | v4.83,66.67 9.4,66.67 10.03,67.31 v13.46,67.31
  Bottom 0.152: v78.74,23.75 78.49,23.5 76.07,23.5 75.95,23.62 51.82,23.62 51.69,23.5 33.65,23.5 33.4,23.75 31.75,23.75 31.24,23.24 28.19,23.24 20.57,30.86 12.32,30.86 11.56,31.62 11.56,34.92 10.54,35.94 3.17,35.94 1.78,37.34 1.78,56.52 4.06,58.8 4.06,65.91 v4.83,66.67 | v13.46,67.31 13.97,66.8 17.27,66.8 18.67,68.2 AVR_ADDR_SREG0.14
AVR_ADDR_UP  (via drill 0.3)
  Top 0.152: IC1.19 80.44,28.12 v80.01,27.69 | v75.69,27.69 75.69,35.31 73.41,37.59 68.33,37.59 66.68,35.94 66.68,26.54 65.02,24.89 58.04,24.89 57.4,25.53 57.4,30.23 54.36,33.27 54.36,36.45 52.7,38.1 15.62,38.1 14.99,38.73 2.03,38.73 1.78,38.99 1.78,48.64 2.03,48.9 5.46,48.9 5.84,49.28 v10.03,49.28
  Bottom 0.152: v75.69,27.69 v80.01,27.69 | v10.03,49.28 AVR_ADDR_CNT0.5
AVR_CS/  (via drill 0.3)
  Top 0.152: IC1.40 94.61,30.48 v97.16,30.48
  Bottom 0.152: v97.16,30.48 97.16,59.56 100.33,62.74 100.33,80.39 99.19,81.53 76.84,81.53 76.2,82.17 64.14,82.17 63.5,81.53 63.5,74.8 64.01,74.3 69.43,74.3 R_CS.1
AVR_D0
  Top 0.152: IC1.37 95.45,28.12 96.65,26.92 96.65,24.26 98.93,21.97 AVR_DATA_BUF.2
AVR_D1
  Top 0.152: IC1.36 95.49,27.32 96.14,26.67 96.14,23.62 97.66,22.1 AVR_DATA_BUF.3
AVR_D2
  Top 0.152: IC1.35 95.4,26.52 95.63,26.29 95.63,22.99 96.39,22.23 AVR_DATA_BUF.4
AVR_D3
  Top 0.152: IC1.34 94.57,23.28 95.12,22.73 AVR_DATA_BUF.5
AVR_D4
  Top 0.152: AVR_DATA_BUF.6 93.85,21.97 92.77,23.05 IC1.33
AVR_D5
  Top 0.152: AVR_DATA_BUF.7 92.58,22.48 91.97,23.09 IC1.32
AVR_D6
  Top 0.152: AVR_DATA_BUF.8 91.31,22.35 91.17,22.49 IC1.31
AVR_D7
  Top 0.152: IC1.30 90.42,23.87 90.42,22.73 90.04,22.35 AVR_DATA_BUF.9
AVR_D+
  Top 0.152: R_USB_PD+.2 88.89,68.4 ZD_D+.C 91.9,66.93 X1.3 98.55,66.93 99.19,66.29 99.19,64.26 98.55,63.63 98.55,61.09 99.06,60.58 100.58,60.58 100.97,60.2 R_AVR_D+.1
AVR_D-
  Top 0.152: ZD_D-.C 90.97,66.26 | 97.86,58.55 R_AVR_D-.1 97.09,59.44 94.23,59.44 92.33,61.34 92.33,65.41 92.03,65.71 | ZD_D-.C 92.03,65.71 | R_USB_PU-.1 88.89,65.71 ZD_D-.C | X1.2 92.45,66.13 92.03,65.71
AVR_RD/  (via drill 0.3)
  Top 0.152: AVR_DATA_BUF.1 100.2,31.24 99.33,32.12 IC1.42 92.85,32.12 v92.84,32.13 | v60.58,43.56 v60.58,44.83 | v71.25,43.31 73.41,43.31 74.3,44.2 81.41,44.2 81.92,44.7 85.47,44.7 85.98,45.21 v92.84,45.21
  Bottom 0.152: v60.58,44.83 AVR_ADDR_BUF2.7 | v60.58,43.56 70.99,43.56 v71.25,43.31 | v92.84,45.21 v92.84,32.13
AVR_SNES_WR_EN
  Top 0.152: IC1.16 82.94,30.48 80.77,30.48 79.76,31.5 78.49,31.5 77.47,30.48 77.47,27.18 75.69,25.4 75.69,20.95 78.74,17.91 79.38,17.27 NAND_GATES.13
AVR_UART_RX  (via drill 0.3)
  Top 0.152: IC1.9 86.37,33.92 85.85,33.4 84.79,33.4 83.26,34.92 76.84,34.92 73.79,37.97 68.2,37.97 66.17,35.94 66.17,27.3 64.64,25.78 v59.82,25.78 | v52.96,25.78 47.88,25.78 45.09,22.99 43.56,22.99 41.78,21.21 41.78,17.78 40.64,16.64 33.15,16.64 32.51,16 v32.26,16 | v12.7,14.35 12.73,14.32 IC3.1
  Bottom 0.152: v52.96,25.78 v59.82,25.78 | v32.26,16 29.59,16 27.94,14.35 v12.7,14.35
AVR_UART_TX  (via drill 0.3)
  Top 0.152: IC1.10 85.57,34.27 85.47,34.16 84.68,34.16 83.41,35.43 76.96,35.43 74.04,38.35 67.69,38.35 65.66,36.32 65.66,27.69 64.39,26.42 v60.58,26.42 | v51.18,26.42 48.01,26.42 44.96,23.37 43.31,23.37 41.4,21.46 41.4,17.91 40.51,17.02 32.77,17.02 v32,17.78 | v12.57,16.89 12.55,16.92 IC3.5
  Bottom 0.152: v51.18,26.42 v60.58,26.42 | v32,17.78 31.12,16.89 v12.57,16.89
AVR_WR/  (via drill 0.3)
  Top 0.152: v70.99,40.01 76.84,40.01 77.09,39.75 77.09,39.12 77.47,38.73 78.49,38.73 79.12,39.37 79.12,40.77 82.68,44.32 v91.31,44.32 | v91.31,31.24 91.39,31.32 IC1.41
  Bottom 0.152: AVR_ADDR_BUF2.6 59.31,43.31 59.69,42.93 70.23,42.93 70.99,42.16 v70.99,40.01 | v91.31,44.32 v91.31,31.24
CS/  (via drill 0.3 pad 0.61)
  Top 0.152: SNES_CTRL_BUF.13 v69.22,36.45
  Bottom 0.152: v69.22,36.45 69.72,36.96 71.63,36.96 71.88,37.21 71.88,42.29 72.26,42.67 72.26,43.69 71.88,44.07 71.88,76.83 71.25,77.47 RAM_CS_DEMUX.4 RAM_CS_DEMUX.5 66.1,76.16 R_CS.2
CS_RAM0  (via drill 0.3)
  Top 0.152: RAM0.22 v5.33,74.93
  Bottom 0.152: RAM_CS_DEMUX.15 5.97,80.01 5.33,79.38 v5.33,74.93
CS_RAM1  (via drill 0.3)
  Top 0.152: RAM1.22 22.61,74.93 v22.99,75.31
  Bottom 0.152: RAM_CS_DEMUX.14 23.37,78.74 22.99,78.36 v22.99,75.31
CS_RAM2  (via drill 0.3)
  Top 0.152: RAM2.22 v40.51,74.93
  Bottom 0.152: RAM_CS_DEMUX.13 40.77,77.47 40.51,77.22 v40.51,74.93
CS_RAM3  (via drill 0.3)
  Top 0.152: v54.86,74.93 RAM3.22
  Bottom 0.152: RAM_CS_DEMUX.12 55.24,76.2 54.99,75.95 54.99,75.06 v54.86,74.93
CS_RAM4  (via drill 0.3)
  Top 0.152: RAM4.22 4.32,52.07 v5.33,53.09
  Bottom 0.152: v5.33,53.09 5.33,61.47 6.1,62.23 6.1,73.15 9.02,76.07 21.72,76.07 21.97,75.82 21.97,74.8 22.1,74.68 33.78,74.68 34.54,75.44 34.54,77.34 35.05,77.85 38.73,77.85 39.24,77.34 39.24,74.93 39.88,74.3 41.53,74.3 41.66,74.42 41.66,76.45 41.91,76.71 45.72,76.71 45.97,76.45 45.97,74.8 46.1,74.68 53.97,74.68 54.48,74.17 55.37,74.17 56.13,74.93 RAM_CS_DEMUX.11
CS_RAM5  (via drill 0.3)
  Top 0.152: RAM5.22 23.37,52.07 v23.88,52.58 | v10.29,44.45 11.56,44.45 12.06,43.94 v13.59,43.94
  Bottom 0.152: RAM_CS_DEMUX.10 54.36,73.66 53.72,74.3 45.85,74.3 45.59,74.55 45.59,76.07 45.47,76.2 42.16,76.2 42.04,76.07 42.04,74.3 41.4,73.66 40,73.66 38.86,74.8 38.86,77.22 38.61,77.47 35.18,77.47 34.92,77.22 34.92,75.18 34.04,74.3 21.84,74.3 21.46,74.68 21.46,75.56 9.52,75.56 6.99,73.03 6.99,60.33 6.73,60.07 6.73,59.44 6.86,59.31 6.86,53.72 7.11,53.47 7.11,52.58 6.86,52.32 6.86,46.61 7.49,45.97 9.27,45.97 9.52,45.72 9.52,44.96 10.03,44.45 v10.29,44.45 | v23.88,52.58 22.99,52.58 22.61,52.2 22.61,49.66 22.35,49.4 19.94,49.4 18.54,48.01 18.54,44.7 17.78,43.94 v13.59,43.94
CS_RAM6  (via drill 0.3)
  Top 0.152: RAM6.22 40.26,52.07 v41.02,52.83
  Bottom 0.152: RAM_CS_DEMUX.9 58.67,72.39 58.29,72.77 45.09,72.77 44.96,72.9 44.96,75.06 44.45,75.56 43.05,75.56 42.67,75.18 42.67,73.28 43.31,72.64 43.31,62.36 43.05,62.1 42.16,62.1 41.91,62.36 41.91,64.64 41.53,65.02 34.67,65.02 34.29,64.64 34.29,61.59 37.34,58.55 37.34,55.75 36.83,55.24 33.65,55.24 33.27,55.63 33.27,58.42 32.77,58.93 31.12,58.93 30.73,58.55 30.73,55.5 32.64,53.59 37.97,53.59 38.73,52.83 v41.02,52.83
CS_RAM7  (via drill 0.3)
  Top 0.152: RAM7.22 59.31,52.07 v60.2,52.96
  Bottom 0.152: RAM_CS_DEMUX.7 67.56,73.66 68.83,72.39 68.83,59.94 69.98,58.8 69.98,49.66 66.68,46.35 66.68,44.96 65.91,44.2 60.32,44.2 59.94,44.58 59.94,49.02 60.2,49.28 v60.2,52.96
D0  (via drill 0.3)
  Top 0.152: RAM0.13 18.16,77.47 18.8,78.11 27.18,78.11 27.81,77.47 RAM1.13 35.94,77.47 36.58,78.11 44.96,78.11 45.59,77.47 RAM2.13 53.72,77.47 54.36,78.11 64.77,78.11 65.41,77.47 RAM3.13 77.47,77.47 77.72,77.72 90.93,77.72 93.47,75.18 v95.25,75.18 | RAM4.13 18.16,54.61 18.8,55.24 27.18,55.24 27.81,54.61 RAM5.13 36.07,54.61 36.7,55.24 44.96,55.24 45.59,54.61 RAM6.13 53.85,54.61 54.48,55.24 62.74,55.24 63.37,54.61 RAM7.13 70.99,54.61 72.14,55.75 91.31,55.75 91.82,55.24 v96.27,55.24 | AVR_DATA_BUF.18 97.66,13.21 97.28,12.83 87.38,12.83 v87,13.21
  Bottom 0.152: v95.25,75.18 95.25,72.9 92.71,70.36 92.71,62.99 96.27,59.44 v96.27,55.24 96.27,13.46 96.01,13.21 v87,13.21 75.18,13.21 73.66,11.68 60.71,11.68 60.32,12.06 SNES_DATA_BUF.11
D1  (via drill 0.3)
  Top 0.152: RAM0.14 18.16,78.74 18.8,79.38 27.18,79.38 27.81,78.74 RAM1.14 35.94,78.74 36.58,79.38 44.96,79.38 45.59,78.74 RAM2.14 53.72,78.74 54.36,79.38 64.77,79.38 65.41,78.74 RAM3.14 93.6,78.74 v94.49,77.85 | RAM4.14 18.16,55.88 18.8,56.52 27.18,56.52 27.81,55.88 RAM5.14 36.07,55.88 36.7,56.52 44.96,56.52 45.59,55.88 RAM6.14 53.85,55.88 54.48,56.52 62.74,56.52 63.37,55.88 RAM7.14 70.99,55.88 71.88,56.77 91.57,56.77 92.08,57.28 92.84,57.28 93.98,56.13 v95.5,56.13 | AVR_DATA_BUF.17 96.39,17.53 v95.5,18.41
  Bottom 0.152: v94.49,77.85 94.49,72.77 92.2,70.48 92.2,62.87 95.5,59.56 v95.5,56.13 v95.5,18.41 95.5,14.22 95.25,13.97 75.31,13.97 73.53,12.19 62.23,12.19 61.59,12.83 SNES_DATA_BUF.12
D2  (via drill 0.3)
  Top 0.152: RAM0.15 18.16,80.01 18.8,80.64 27.18,80.64 27.81,80.01 RAM1.15 35.94,80.01 36.58,80.64 44.96,80.64 45.59,80.01 RAM2.15 53.72,80.01 54.36,80.64 64.77,80.64 65.41,80.01 RAM3.15 94.36,80.01 v94.74,80.39 | RAM4.15 18.16,57.15 18.8,57.78 27.18,57.78 27.81,57.15 RAM5.15 36.07,57.15 36.7,57.78 44.96,57.78 45.59,57.15 RAM6.15 53.85,57.15 54.48,57.78 62.74,57.78 63.37,57.15 RAM7.15 70.99,57.15 71.63,57.78 90.42,57.78 92.08,59.44 93.6,59.44 v94.74,58.29 | AVR_DATA_BUF.16 95.12,16.76 v94.74,17.14
  Bottom 0.152: v94.74,80.39 94.74,79.5 93.73,78.49 93.73,72.64 91.69,70.61 91.69,62.74 94.74,59.69 v94.74,58.29 v94.74,17.14 94.74,14.99 94.49,14.73 75.44,14.73 73.41,12.7 63.37,12.7 62.86,13.21 SNES_DATA_BUF.13
D3  (via drill 0.3)
  Top 0.152: RAM0.17 v5.33,81.28 9.4,81.28 10.03,80.64 18.16,80.64 18.8,81.28 RAM1.17 27.18,81.28 27.81,80.64 35.94,80.64 36.58,81.28 RAM2.17 44.96,81.28 45.59,80.64 53.72,80.64 54.36,81.28 RAM3.17 | v92.08,60.33 90.04,58.29 71.5,58.29 70.99,57.78 63.37,57.78 62.74,58.42 RAM7.17 55.12,58.42 54.99,58.29 54.36,58.29 53.85,57.78 45.59,57.78 44.96,58.42 RAM6.17 36.7,58.42 36.07,57.78 27.81,57.78 27.18,58.42 23.88,58.42 23.75,58.29 23.11,58.29 22.99,58.42 RAM5.17 18.8,58.42 18.16,57.78 10.03,57.78 9.4,58.42 RAM4.17 v3.3,59.69 | AVR_DATA_BUF.15 93.85,18.16 v93.98,18.29
  Bottom 0.152: v92.08,60.33 92.33,60.33 93.98,58.67 v93.98,18.29 93.98,15.75 93.73,15.49 75.56,15.49 73.28,13.21 64.52,13.21 64.14,13.59 SNES_DATA_BUF.14 | v3.3,59.69 3.3,79.12 5.33,81.15 v5.33,81.28
D4  (via drill 0.3)
  Top 0.152: RAM0.18 9.4,80.01 10.03,79.38 18.16,79.38 18.8,80.01 RAM1.18 27.18,80.01 27.81,79.38 35.94,79.38 36.58,80.01 RAM2.18 44.96,80.01 45.59,79.38 53.72,79.38 54.36,80.01 RAM3.18 64.77,80.01 65.41,79.38 v93.22,79.38 | RAM4.18 9.4,57.15 10.03,56.52 18.16,56.52 18.8,57.15 RAM5.18 27.18,57.15 27.81,56.52 36.07,56.52 36.7,57.15 RAM6.18 44.96,57.15 45.59,56.52 53.85,56.52 54.48,57.15 RAM7.18 62.74,57.15 63.37,56.52 70.99,56.52 71.76,57.28 91.06,57.28 92.08,58.29 v93.22,58.29 | v92.58,16.26 AVR_DATA_BUF.14
  Bottom 0.152: v93.22,79.38 93.22,72.77 91.19,70.74 91.19,58.55 91.44,58.29 v93.22,58.29 93.22,46.1 93.47,45.85 93.47,44.7 93.22,44.45 93.22,32.89 93.47,32.64 93.47,31.75 93.22,31.5 93.22,16.51 92.96,16.26 v92.58,16.26 75.69,16.26 73.15,13.72 65.79,13.72 65.41,14.1 SNES_DATA_BUF.15
D5  (via drill 0.3)
  Top 0.152: RAM0.19 9.4,78.74 10.03,78.11 18.16,78.11 18.8,78.74 RAM1.19 27.18,78.74 27.81,78.11 35.94,78.11 36.58,78.74 RAM2.19 44.96,78.74 45.59,78.11 53.72,78.11 54.36,78.74 RAM3.19 64.77,78.74 65.41,78.11 92.08,78.11 v92.46,77.72 | RAM4.19 9.4,55.88 10.03,55.24 18.16,55.24 18.8,55.88 RAM5.19 27.18,55.88 27.81,55.24 36.07,55.24 36.7,55.88 RAM6.19 44.96,55.88 45.59,55.24 53.85,55.24 54.48,55.88 RAM7.19 62.74,55.88 63.37,55.24 70.99,55.24 72.01,56.26 92.2,56.26 v92.46,56.52 | v91.31,17.02 AVR_DATA_BUF.13
  Bottom 0.152: v92.46,77.72 92.46,72.64 90.68,70.87 90.68,57.15 91.31,56.52 v92.46,56.52 92.46,45.85 92.2,45.59 92.2,44.96 92.46,44.7 92.46,32.77 92.2,32.51 92.2,31.75 92.46,31.5 92.46,17.27 92.2,17.02 v91.31,17.02 75.82,17.02 73.03,14.22 66.8,14.22 66.68,14.35 SNES_DATA_BUF.16
D6  (via drill 0.3)
  Top 0.152: RAM0.20 9.4,77.47 10.03,76.83 18.16,76.83 18.8,77.47 RAM1.20 27.18,77.47 27.81,76.83 35.94,76.83 36.58,77.47 RAM2.20 44.96,77.47 45.59,76.83 53.72,76.83 54.36,77.47 RAM3.20 64.77,77.47 65.41,76.83 77.47,76.83 77.85,77.22 90.42,77.22 91.69,75.95 v91.69,75.18 | RAM4.20 9.4,54.61 10.03,53.98 18.16,53.98 18.8,54.61 RAM5.20 27.18,54.61 27.81,53.98 36.07,53.98 36.7,54.61 RAM6.20 39.62,54.61 39.75,54.74 44.83,54.74 45.59,53.98 53.85,53.98 54.48,54.61 RAM7.20 57.78,54.61 57.91,54.74 62.61,54.74 63.37,53.98 70.99,53.98 72.26,55.24 90.42,55.24 91.31,54.36 v91.69,54.36 | v90.04,17.78 AVR_DATA_BUF.12
  Bottom 0.152: v91.69,75.18 91.69,72.52 90.17,70.99 90.17,56.64 91.69,55.12 v91.69,54.36 91.69,44.83 91.95,44.58 91.95,43.31 91.69,43.05 91.69,31.75 91.95,31.5 91.95,30.86 91.57,30.48 91.57,18.03 91.31,17.78 v90.04,17.78 75.95,17.78 72.9,14.73 68.2,14.73 67.95,14.99 SNES_DATA_BUF.17
D7  (via drill 0.3)
  Top 0.152: RAM0.21 9.4,76.2 10.03,75.56 18.16,75.56 18.8,76.2 RAM1.21 22.23,76.2 22.48,76.45 26.92,76.45 27.81,75.56 35.94,75.56 36.58,76.2 RAM2.21 44.96,76.2 45.59,75.56 53.72,75.56 54.36,76.2 RAM3.21 64.77,76.2 65.41,75.56 70.87,75.56 | RAM4.21 4.57,53.34 5.21,53.98 8.76,53.98 10.03,52.7 18.16,52.7 18.8,53.34 RAM5.21 22.35,53.34 22.61,53.59 26.92,53.59 27.81,52.7 36.07,52.7 36.7,53.34 RAM6.21 40.26,53.34 40.64,53.72 44.58,53.72 45.59,52.7 53.85,52.7 54.48,53.34 RAM7.21 58.04,53.34 58.42,53.72 62.36,53.72 63.37,52.7 70.99,52.7 72.14,53.85 89.28,53.85 90.17,52.96 v90.93,52.96 | 70.87,75.56 71.12,75.56 | 70.87,75.56 77.6,75.56 77.98,75.95 89.28,75.95 v90.93,74.3 | v88.77,18.54 AVR_DATA_BUF.11
  Bottom 0.152: v90.93,74.3 90.93,72.39 89.66,71.12 89.66,56.13 90.93,54.86 v90.93,52.96 90.93,45.21 90.55,44.83 90.55,43.43 90.93,43.05 90.93,31.88 90.68,31.62 90.68,30.73 90.93,30.48 90.93,18.8 90.68,18.54 v88.77,18.54 72.39,18.54 71.88,18.92 69.34,18.92 69.22,18.8 SNES_DATA_BUF.18
GND  (via drill 0.3, 0.3 pad 0.61)
  Top 0.152: 45.59,58.42 45.21,59.05 v44.58,59.05 | v54.61,58.93 53.85,58.42 RAM6.16 | v24.38,5.71 U$2.36 | v32.26,10.03 32.26,10.16 | v79.12,30.73 79.25,30.61 | C_FTDI_3.3.1 10.79,25.02 11.3,25.53 11.3,29.97 10.79,30.48 8.89,30.48 X3.5 | v58.67,5.97 58.67,6.22 | v45.85,9.4 45.85,9.53 | v12.57,58.67 12.45,58.55 12.32,58.67 | v23.5,58.93 23.62,58.93 | v33.27,59.44 33.15,59.56 | v65.66,59.05 65.41,59.05 | v65.79,38.48 65.53,38.48 | v18.29,8 18.29,7.87 | v18.29,18.16 18.42,18.03 | v68.2,18.67 68.2,18.54 | v13.72,72.39 13.59,72.39
  Bottom 0.152: U$2.36 v24.38,5.71 23.88,6.35 23.88,11.43 v24.38,11.94 | v32.26,10.03 32.28,10.01 SNES_ADDR_BUFHIROM.10 33.27,13.08 32.32,14.03 C_FTDI_3.4.1 | v79.12,37.21 v79.12,33.53 v79.12,30.73 | v52.58,35.81 v60.2,35.81 | v88.27,28.7 v88.27,31.62 | SNES_DATA_BUF.10 60.32,7.62 v58.67,5.97 | SNES_ADDR_BUFLOROM.10 46.86,9.4 v45.85,9.4 | AVR_ADDR_CNT2.8 27.56,47.24 26.82,46.51 26.82,46.46 26.86,46.42 | AVR_ADDR_BUF1.10 47.9,46.51 48.89,47.5 AVR_ADDR_CNT4.8 | AVR_ADDR_SREG2.8 54.99,59.31 v54.61,58.93 54.58,58.93 55.24,58.27 AVR_ADDR_CNT4.14 | AVR_ADDR_SREG0.8 v12.32,61.85 | 66.06,62.64 v66.04,62.61 67.31,63.88 C_DEMUX.1 67.37,65.66 66.42,65.66 66.06,66.02 RAM_CS_DEMUX.8 63.12,72.39 61.59,70.87 60.32,70.87 60.07,70.61 AVR_ADDR_SREG2.13 | AVR_ADDR_CNT3.8 38.23,49.28 37.34,48.39 37.34,44.96 | AVR_ADDR_SREG1.8 33.65,61.09 v35.81,58.93 | 43.31,44.7 37.59,44.7 37.34,44.96 | AVR_ADDR_BUF1.10 43.05,44.96 43.31,44.7 | AVR_ADDR_CNT5.8 59.56,52.32 59.18,52.7 59.18,53.34 59.44,53.59 60.96,53.59 61.47,53.09 61.47,49.28 61.21,49.02 61.21,45.34 61.85,44.7 64.14,44.7 64.39,44.96 | 64.39,44.96 AVR_ADDR_BUF2.10 | 64.39,44.96 64.64,44.7 65.66,44.7 66.17,45.21 66.17,46.48 69.47,49.78 69.47,58.67 v67.82,60.33 | v6.35,52.83 6.22,52.7 AVR_ADDR_CNT0.8 6.07,51.18 3.94,51.18 3.56,51.56 C_CNT0.1 | AVR_ADDR_BUF0.10 21.72,44.07 20.7,43.05 12.57,43.05 12.06,43.56 | 12.06,43.56 12.06,44.45 12.45,44.83 15.87,44.83 16,44.96 16,50.8 16.13,50.93 16.79,50.93 AVR_ADDR_CNT1.8 | AVR_ADDR_BUF0.10 21.59,45.72 | AVR_ADDR_BUF1.10 43.18,45.72 | AVR_ADDR_CNT0.14 v12.57,58.67 | AVR_ADDR_CNT1.14 23.24,58.67 v23.5,58.93
  Bottom 0.152: AVR_ADDR_CNT2.14 33.91,58.8 v33.27,59.44 | AVR_ADDR_CNT3.14 v44.58,59.05 | AVR_ADDR_CNT5.14 65.91,58.8 v65.66,59.05 | v65.79,38.48 67.18,39.88 67.18,41.91 66.55,42.55 58.55,42.55 56.77,44.32 50.73,44.32 C_BUF2.1 50.35,44.7 43.31,44.7 | v77.47,20.19 v79.88,20.19 | AVR_ADDR_BUF0.10 26.77,46.51 26.86,46.42 | CIC.8 v18.29,8 | CIC.4 v18.29,18.16 | C_FTDI_3.5.1 v68.2,18.67 | C_BUF0.1 8.95,43.43 11.94,43.43 12.06,43.56 | 26.86,46.42 28.89,44.38 C_BUF1.1 36.76,44.38 37.34,44.96 | AVR_ADDR_SREG1.13 38.73,70.87 38.48,71.12 36.96,71.12 36.83,70.99 36.83,67.94 36.45,67.56 26.29,67.56 21.84,72.01 17.91,72.01 | 17.91,72.01 17.4,71.5 AVR_ADDR_SREG0.13 | 17.91,72.01 17.53,72.39 v13.72,72.39
  pour Top: 0,7.62 arc90 1.27,6.35 20.07,6.35 20.19,6.35 arc-90 22.1,4.45 22.1,0 82.42,0 82.42,4.45 arc-90 84.33,6.35 101.73,6.35 arc90 103,7.62 103,81.28 arc90 100.46,83.82 1.91,83.82 arc90 0,81.92
HI/LOROM_SW  (via drill 0.3)
  Top 0.152: v59.31,18.67 59.44,18.54 59.44,14.61 59.94,14.1 76.33,14.1 | IC1.15 81.2,31.32 80.52,32 77.98,32 76.96,30.99 76.96,27.3 76.58,26.92 | 76.58,26.92 76.2,26.54 | 76.58,26.92 75.31,25.65 75.31,20.83 77.6,18.54 77.6,14.61 77.09,14.1 76.33,14.1 | NAND_GATES.5 75.79,13.56 76.33,14.1
  Bottom 0.152: v59.31,18.67 58.8,18.67 58.55,18.41 55.5,18.41 54.86,19.05 52.32,19.05 51.82,19.56 49.53,19.56 49.02,19.05 47.75,19.05 47.5,19.3 44.7,19.3 43.43,18.03 SNES_ADDR_BUFHIROM.19
HI/LOROM_SW_INV  (via drill 0.3)
  Top 0.152: NAND_GATES.6 74.68,12.19 73.15,13.72 57.66,13.72 v57.02,14.35
  Bottom 0.152: v57.02,14.35 SNES_ADDR_BUFLOROM.19
ISP_MISO
  Top 0.152: IC1.2 91.97,36.6 92.08,36.7 95.5,36.7 96.39,37.59 96.39,41.66 96.77,42.04 SV2.4
ISP_MOSI
  Top 0.152: IC1.1 95.08,35.52 96.9,37.34 96.9,39.24 97.16,39.5 SV2.5
ISP_RST
  Top 0.152: IC1.4 90.37,36.91 91.19,37.72 95.12,37.72 95.38,37.97 95.38,46.48 | 95.38,46.48 96.01,47.12 | R_RST.1 97.16,52.2 96.01,51.05 96.01,47.12 | 96.01,47.12 SV2.2 | C_RST.2 94.74,47.12 95.38,46.48
ISP_SCK
  Top 0.152: IC1.3 91.17,37.07 91.31,37.21 95.25,37.21 95.89,37.85 95.89,44.32 96.14,44.58 SV2.3
LED
  Top 0.152: LED1.A 79.98,23.81 R_LED1.1 82.23,23.88 83.57,23.88 83.82,23.62 83.82,22.73 84.2,22.35 87,22.35 87.17,22.53 IC1.26
MMC_CS
  Top 0.152: IC1.44 94.57,34.25 97.28,36.96 SV2.6
N$1
  Bottom 0.152: AVR_ADDR_CNT0.7 7.49,49.15 8.64,48.01 11.43,48.01 11.56,47.88 AVR_ADDR_BUF0.2
N$2
  Bottom 0.152: AVR_ADDR_CNT2.3 33.91,49.53 35.43,48.01 AVR_ADDR_BUF1.4
N$3
  Bottom 0.152: AVR_ADDR_CNT0.2 13.84,49.28 15.37,47.75 AVR_ADDR_BUF0.5
N$4
  Bottom 0.152: AVR_ADDR_CNT0.3 12.57,49.53 14.1,48.01 AVR_ADDR_BUF0.4
N$5
  Bottom 0.152: AVR_ADDR_CNT1.7 18.16,49.53 16.64,48.01 AVR_ADDR_BUF0.6
N$6
  Bottom 0.152: AVR_ADDR_CNT1.6 19.43,49.91 17.91,48.39 AVR_ADDR_BUF0.7
N$7
  Bottom 0.152: AVR_ADDR_BUF0.9 20.45,47.75 21.08,48.39 23.24,48.39 24.51,49.66 AVR_ADDR_CNT1.2
N$8
  Bottom 0.152: AVR_ADDR_BUF0.8 19.18,47.88 20.19,48.9 22.61,48.9 23.24,49.53 AVR_ADDR_CNT1.3
N$9
  Bottom 0.152: AVR_ADDR_CNT0.12 10.03,54.1 10.54,53.59 19.43,53.59 20.7,52.32 AVR_ADDR_CNT1.5
N$10
  Bottom 0.152: AVR_ADDR_CNT0.13 11.3,54.36 11.56,54.1 20.7,54.1 21.97,52.83 AVR_ADDR_CNT1.4
N$11
  Bottom 0.152: AVR_ADDR_SREG0.9 12.29,69.6 11.43,69.6 11.05,69.98 11.05,74.17 11.56,74.68 20.57,74.68 21.84,73.41 34.54,73.41 36.45,75.31 37.34,75.31 40,72.64 AVR_ADDR_SREG1.14
N$12
  Bottom 0.152: AVR_ADDR_SREG0.15 19.94,66.42 18.92,65.41 11.81,65.41 11.3,64.9 11.3,61.09 13.84,58.55 AVR_ADDR_CNT0.15
N$13
  Bottom 0.152: AVR_ADDR_SREG0.1 21.21,67.56 20.57,68.2 20.57,70.87 20.45,70.99 19.43,70.99 19.3,70.87 19.3,68.2 17.14,66.04 11.18,66.04 10.41,65.28 10.41,59.56 9.4,58.55 9.4,53.47 9.78,53.09 14.35,53.09 15.11,52.32 AVR_ADDR_CNT0.1
N$14  (via drill 0.3)
  Top 0.152: v7.49,59.82 19.05,59.82 v19.69,60.45
  Bottom 0.152: v19.69,60.45 19.94,60.71 AVR_ADDR_SREG0.2 | AVR_ADDR_CNT0.10 v7.49,59.82